# Altium project schematic_tutorial.PrjPcb
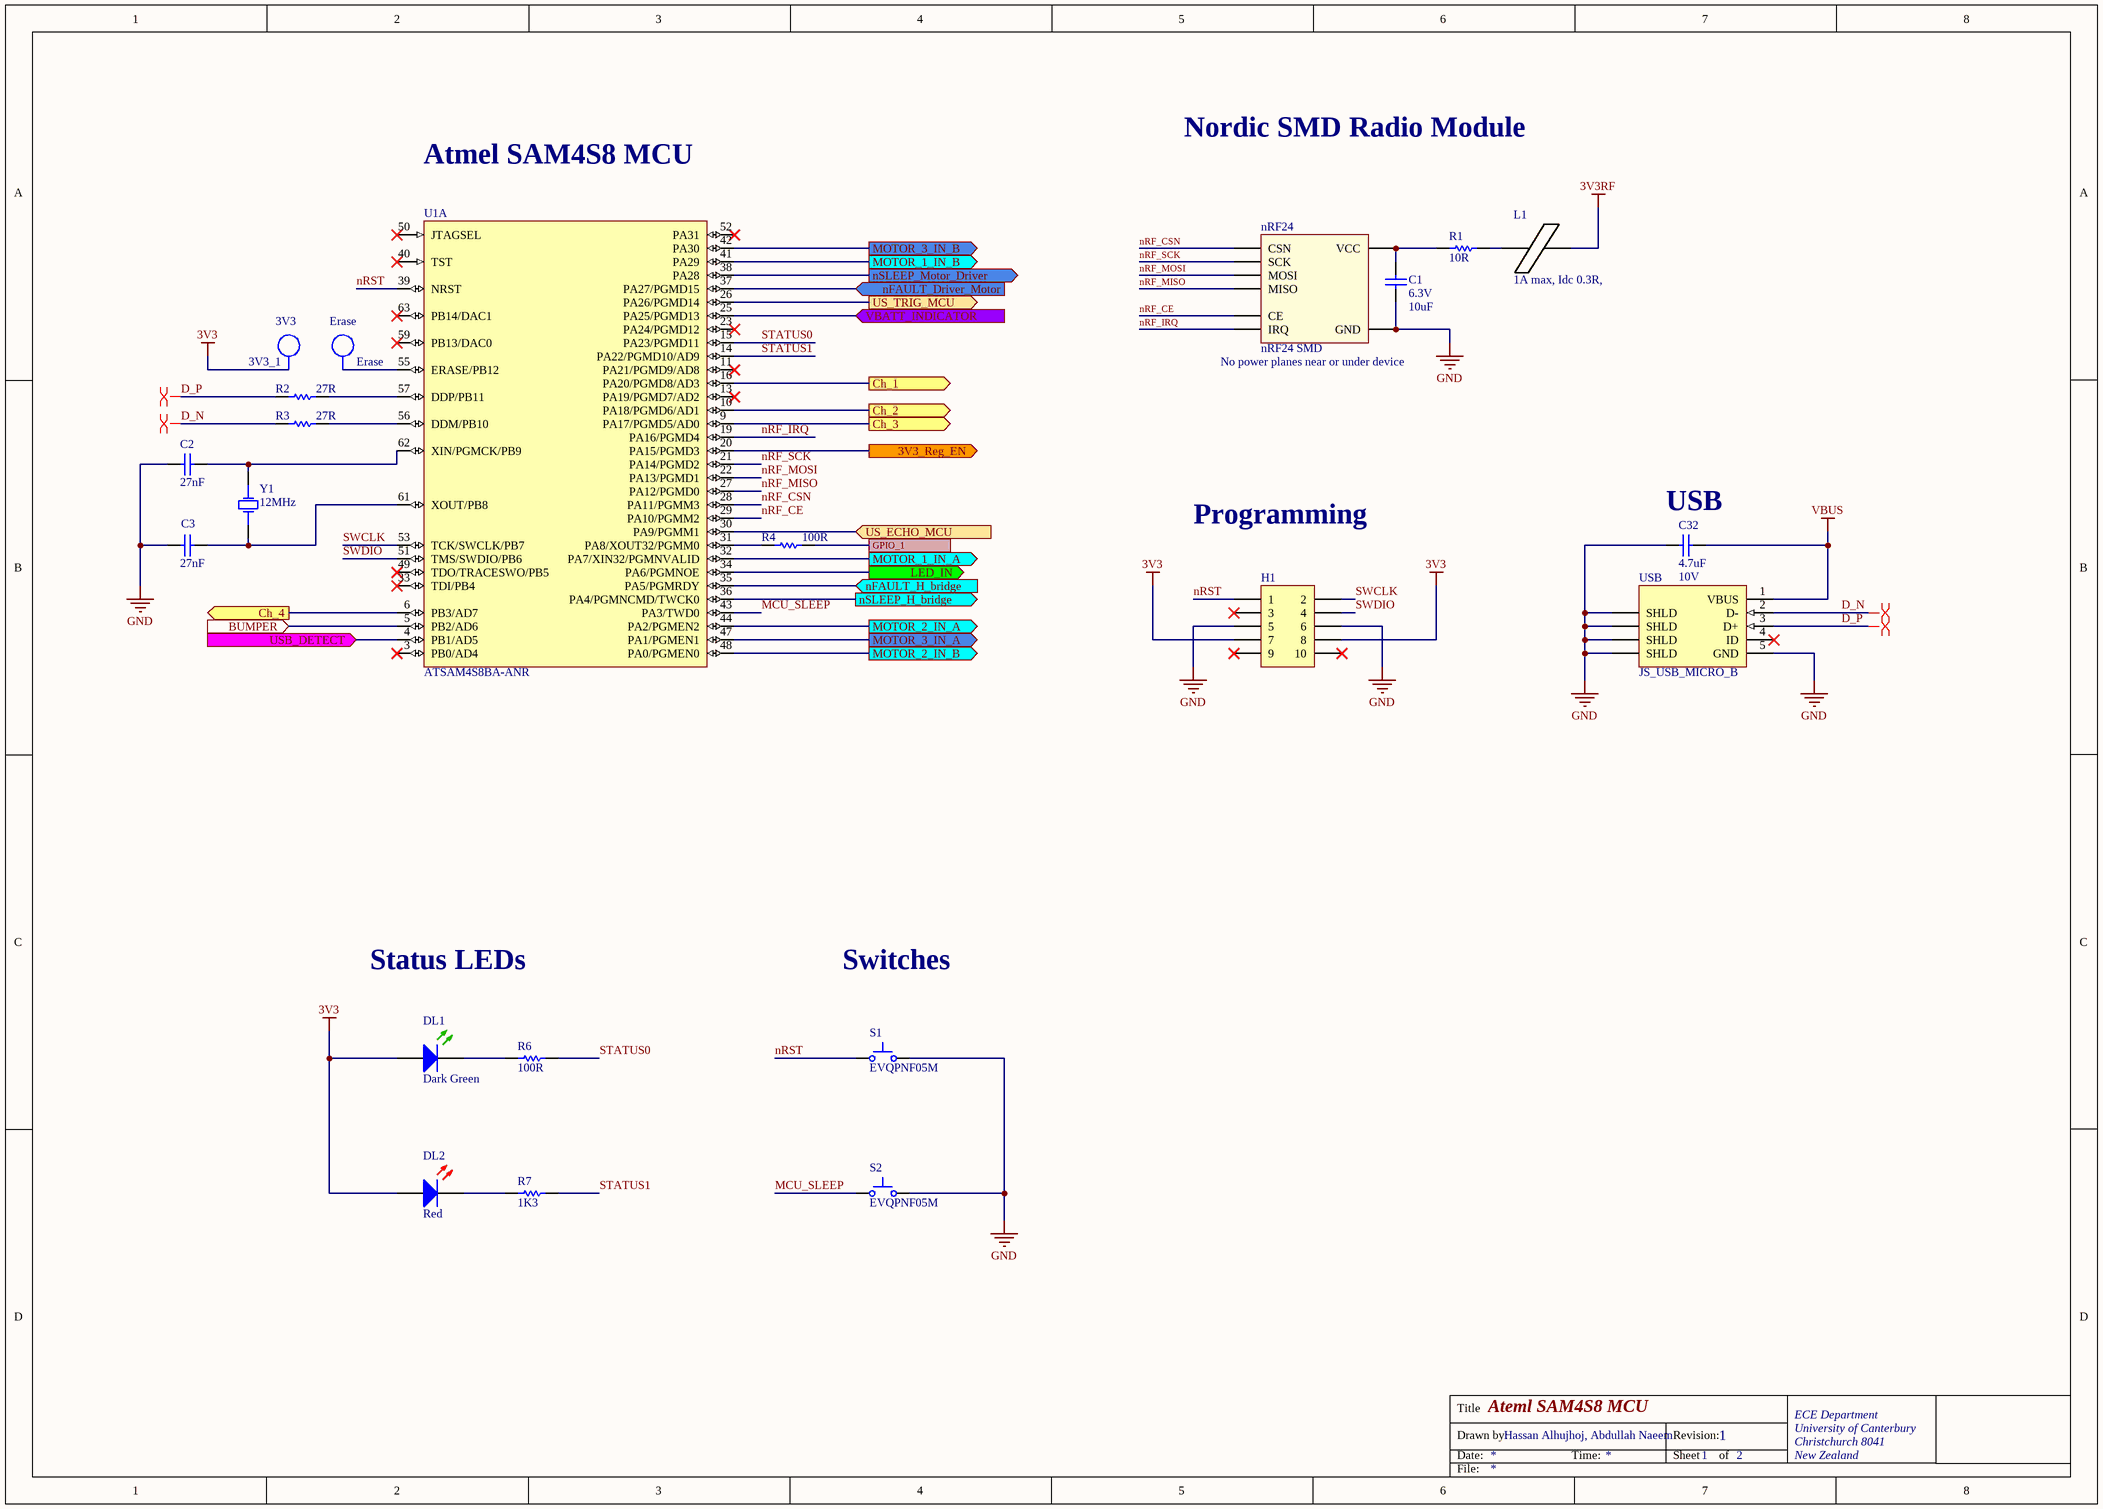
[diagram p0: MCU.SchDoc]
3 sheets, 86 parts. Net scope: global (net labels, ports and power ports of the same name join across sheets).
Sheets:
  MCU.SchDoc
  Power.SchDoc
  Headers.SchDoc

## Sheet MCU.SchDoc: Ateml SAM4S8 MCU
size A3; DrawnBy: Hassan Alhujhoj, Abdullah Naeem; Address1: ECE Department; Address2: University of Canterbury; Address3: Christchurch 8041; Address4: New Zealand; Revision: 1; SheetNumber: 1; SheetTotal: 2

### Parts
3V3_1  TP  [TP_1206]  (value not drawn)  (no BOM)
C1  Voltage - Rated: 6.3V  [CAPC1608L]  (hidden comment: 10uF)
C2  27nF  [CAPC1608L]
C3  27nF  [CAPC1608L]
C32  Max Voltage: 10V  [CAPC1608N]  (hidden comment: 4.7uF)
DL1  Dark Green  [WL-SMCW0603]
DL2  Red  [WL-SMCW0603]
Erase  TP  [TP_1206]  (value not drawn)  (no BOM)
H1  Header 5X2 Vert  [IDC2.54-V10D]  (value not drawn)
L1  1A max, Idc 0.3R,  [INDC3216L]
nRF24  nRF24 SMD  Warning: No power planes near or under device  [NRF24]
R1  10R  [RESC1608L]
R2  27R  [RESC1608L]
R3  27R  [RESC1608L]
R4  100R  [RESC1608L]
R6  100R  [RESC1608L]
R7  1K3  [RESC1608L]
S1  EVQPNF05M  [EVQPNF05M]
S2  EVQPNF05M  [EVQPNF05M]
U1  ATSAM4S8BA-ANR  [LQFP64_L]  (part A of 2)
USB  JS_USB_MICRO_B  [FCI_USB_10118194-0001LF]
Y1  12MHz  [6.0X3.5-4]

### Ports
3V3_Reg_EN (out), BUMPER (in), Ch_1 (out), Ch_2 (out), Ch_3 (out), Ch_4 (out), GPIO_1, LED_IN (out), MOTOR_1_IN_A (out), MOTOR_1_IN_B (out), MOTOR_2_IN_A (out), MOTOR_2_IN_B (out), MOTOR_3_IN_A (out), MOTOR_3_IN_B (out), nFAULT_Driver_Motor (in), nFAULT_H_bridge (in), nSLEEP_H_bridge (out), nSLEEP_Motor_Driver (out), US_ECHO_MCU (in), US_TRIG_MCU (out), USB_DETECT (in), VBATT_INDICATOR (in)

### Nets
3V3: 3V3_1.1 DL1.2(A) DL2.2(A) H1.7 H1.8
3V3RF: L1.2
GND: C1.1 C2.1 C3.1 C32.1 H1.5 H1.6 nRF24.2(GND) S1.2 S2.2 USB.5(GND) USB.6(SHLD)
VBUS: C32.2 USB.1(VBUS)
D_N: R3.1 USB.2(D-)
D_P: R2.1 USB.3(D+)
MCU_SLEEP: S2.1 U1.43(PA3/TWD0)
nRF_CE: nRF24.3(CE) U1.29(PA10/PGMM2)
nRF_CSN: nRF24.4(CSN) U1.28(PA11/PGMM3)
nRF_IRQ: nRF24.8(IRQ) U1.19(PA16/PGMD4)
nRF_MISO: nRF24.7(MISO) U1.27(PA12/PGMD0)
nRF_MOSI: nRF24.6(MOSI) U1.22(PA13/PGMD1)
nRF_SCK: nRF24.5(SCK) U1.21(PA14/PGMD2)
nRST: H1.1 S1.1 U1.39(NRST)
STATUS0: R6.2 U1.15(PA23/PGMD11)
STATUS1: R7.2 U1.14(PA22/PGMD10/AD9)
SWCLK: H1.2 U1.53(TCK/SWCLK/PB7)
SWDIO: H1.4 U1.51(TMS/SWDIO/PB6)
Net3V3RF_REG_3: U1.20(PA15/PGMD3) ; port 3V3_Reg_EN
NetBumper_2: U1.5(PB2/AD6) ; port BUMPER
NetC1_2: C1.2 nRF24.1(VCC) R1.1
NetC2_2: C2.2 U1.62(XIN/PGMCK/PB9) Y1.3(OSC2)
NetC3_2: C3.2 U1.61(XOUT/PB8) Y1.1(OSC1)
NetCH1_1: U1.16(PA20/PGMD8/AD3) ; port Ch_1
NetCH2_1: U1.10(PA18/PGMD6/AD1) ; port Ch_2
NetCH3_1: U1.9(PA17/PGMD5/AD0) ; port Ch_3
NetCH4_1: U1.6(PB3/AD7) ; port Ch_4
NetDL1_1: DL1.1(K) R6.1
NetDL2_1: DL2.1(K) R7.1
NetErase_1: Erase.1 U1.55(ERASE/PB12)
NetH4_2: R4.2 ; port GPIO_1
NetH-Bridge_1_1: U1.36(PA4/PGMNCMD/TWCK0) ; port nSLEEP_H_bridge
NetH-Bridge_1_8: U1.35(PA5/PGMRDY) ; port nFAULT_H_bridge
NetH-Bridge_1_9: U1.44(PA2/PGMEN2) ; port MOTOR_2_IN_A
NetH-Bridge_1_10: U1.48(PA0/PGMEN0) ; port MOTOR_2_IN_B
NetH-Bridge_1_15: U1.41(PA29) ; port MOTOR_1_IN_B
NetH-Bridge_1_16: U1.32(PA7/XIN32/PGMNVALID) ; port MOTOR_1_IN_A
NetH-Bridge_2_1: U1.38(PA28) ; port nSLEEP_Motor_Driver
NetH-Bridge_2_8: U1.37(PA27/PGMD15) ; port nFAULT_Driver_Motor
NetH-Bridge_2_9: U1.47(PA1/PGMEN1) ; port MOTOR_3_IN_A
NetH-Bridge_2_10: U1.42(PA30) ; port MOTOR_3_IN_B
NetL1_1: L1.1 R1.2
NetLVL_CON_3: U1.34(PA6/PGMNOE) ; port LED_IN
NetR2_2: R2.2 U1.57(DDP/PB11)
NetR3_2: R3.2 U1.56(DDM/PB10)
NetR4_1: R4.1 U1.31(PA8/XOUT32/PGMM0)
NetR15_1: U1.25(PA25/PGMD13) ; port VBATT_INDICATOR
NetR16_1: U1.4(PB1/AD5) ; port USB_DETECT
NetR17_1: U1.30(PA9/PGMM1) ; port US_ECHO_MCU
NetU1_26: U1.26(PA26/PGMD14) ; port US_TRIG_MCU

Not connected (* = marked no-connect by the designer): H1 3* 9* 10*; U1 3(PB0/AD4)* 11(PA21/PGMD9/AD8)* 13(PA19/PGMD7/AD2)* 23(PA24/PGMD12)* 33(TDI/PB4)* 40(TST)* 49(TDO/TRACESWO/PB5)* 50(JTAGSEL)* 52(PA31)* 59(PB13/DAC0)* 63(PB14/DAC1)*; USB 4(ID)*

### Layout directives
differential pair: D_N, D_P

### Notes on the sheet
- Atmel SAM4S8 MCU
- Nordic SMD Radio Module
- (near 3V3_1) 3V3
- (near Erase) Erase
- (near C32) USB
- Programming
- Status LEDs
- Switches
- Title
- Drawn by:
- Date:
- Time:
- Revision:
- Sheet
- of
- File:

### Library data of the parts
3V3_1 Erase = TP_1206: Test-Point 3.3x1.6x2.1mm SMD; Manufacturer: Harwin Inc; Manufacturer Part Number: S1751-46R; Manufacturer PN: *; Storage Location: ProtoPlace; Mounting Type: Surface Mount; Type: PC Test Point; Supplier 1: Digi-Key; Supplier Part Number 1: 952-1478-2-ND; Supplier 2: Farnell; Supplier Part Number 2: 1826282; Supplier: ECE Dept; Value: TP
C1 = CC_10uF_0603: CAP CER 10UF X5R +-20% 6V3 0603; Supplier: ECE Dept; Storage Location: PCB Assembly WS; Value: 10uF
C2 C3 = CC_27nF_0603: CAP CER 27nF X7R +-10% 50V 0603; PackageReference: 0603; Code_IPC: 1608 [0603]; Verify: *; Supplier: ECE Dept; Storage Location: PCB Assembly WS; Value: 27nF
C32 = CC_4.7uF_0603: CAP CER 4.7uF X5R +-20%  10V 0603; Note: Footprint corresponds to dimensions for bulk cassette packaging. This case size has tightened tolerances.; PackageReference: 0805; Code_IPC: 2012[0805]; Verify: *; Supplier: ECE Dept; Storage Location: PCB Assembly WS; Value: 4.7uF
DL1 = DL_150060GS75000: LED Dk Green 430mcd 0603 SMD; Manufacturer: WURTH ELEKTRONIK; Forward Current If: 30; Wavelength Typ: 520; Forward Voltage: 3.2; Lens Shape: Rectangular; Luminous Intensity: 430; Viewing Angle: 140°; LED Mounting: SMD; Supplier 1: Farnell; Supplier Part Number 1: 2322070; Manufacturer Part Number: 150060GS75000; Storage Location: PCB Assembly WS; Supplier: ECE Dept; LED Colour: Dark Green
DL2 = DL_150060RS75000: LED Red 250mcd 0603 SMD; Manufacturer: WURTH ELEKTRONIK; Forward Current If: 30; Forward Voltage: 2; Lens Shape: Rectangular; Luminous Intensity: 250; Wavelength Typ: 625; Viewing Angle: 140°; LED Mounting: SMD; Supplier 1: Farnell; Supplier Part Number 1: 2322071; Manufacturer Part Number: 150060RS75000; Storage Location: PCB Assembly WS; Supplier: ECE Dept; LED Colour: Red
H1 = JA_HDR_IDC_5X2_VERT: IDC Header, 2,54mm, 10-Pin, Vert; Supplier: ECE Dept; Supplier 1: Farnell; Supplier Part Number 1: 1096985; Storage Location: ECE Dept Store
L1 = IN_Ferrite-Bead: Ferrite Bead, Rdc 0.3R, Z100MHZ 600R, Imax 1A, SMD 1206; Manufacturer: FAIR-RITE; Manufacturer PN: 2512066017Y1; DC Current Rating: 1; DC Resistance Max: 0.08; Ferrite Case Style: 1206 ^3216 Metric]; Frequency Range: 50MHz to 1; Impedance: 600; Impedance Tolerance: ± 25%; Supplier: ECE Dept; Storage Location: PCB Assembly WS; Ferrite Mounting: SMD; Supplier 1: Farnell; Supplier Part Number 1: 1612060; Manufacturer Part Number: 2512066017Y1; Value: 1A max, Idc 0.3R,
nRF24 = NRF24: nRF24 SMD Module
R1 = RS_10R: RES 10 OHM 1/10W 5% 0603 SMD; Storage Location: PCB Assembly WS; Supplier: ECE Dept; Value: 10R
R2 R3 = RS_27R: RES 27 OHM 1/10W 5% 0603 SMD; Storage Location: PCB Assembly WS; Supplier: ECE Dept; Value: 27R
R4 R6 = RS_100R: RES 100 OHM 1/10W 5% 0603 SMD; Storage Location: PCB Assembly WS; Supplier: ECE Dept; Value: 100R
R7 = RS_1K3: RES 1.3K OHM 1/10W 5% 0603 SMD; Storage Location: PCB Assembly WS; Supplier: ECE Dept; Value: 1K3
S1 S2 = WS_EVQPNF05M: Panasonic 6 x 3.5mm SMD Light Touch Switch Type SMD; PackageDescription: 6.0 x 3.5 mm; Supplier 1: Farnell; Supplier Part Number 1: 2079481; Manufacturer: Panasonic; Manufacturer PN: EVQPNF05M; Supplier 2: Digi-Key; Supplier Part Number 2: P13598SCT-ND; Storage Location: PCB Assembly WS; Supplier: ECE Dept
U1 = SE_ATSAM4S16BA-MU: IC MCU 32BIT 512KB FLASH 64LQFP; Manufacturer: Atmel; Connectivity: I²C, IrDA, Memory Card, SPI, SSC, UART/USART, USB; Core Processor: ARM® Cortex®-M4; Core Size: 32-Bit; Data Converters: A/D 11x12b, D/A 2x12b; Number of I/O: 47; Peripherals: Brown-out Detect/Reset, DMA, POR, PWM, WDT; Program Memory Size: 512KB (512K x 8); RAM Size: 128K x 8; Speed: 120MHz; Voltage - Supply (Vcc/Vdd): 1.62 V ~ 3.6 V; PackageVersion: revJ, Jul-2007; PackageReference: 64PS; PackageDescription: 64-Pin Quad Flat No-Lead (QFN) Sawn, 9 x 9 x 1.0 mm Body, 0.5 mm Pitch, Exposed Pad; Code_JEDEC: MO-220VMMD-3; ComponentLink1Description: Manufacturer URL; ComponentLink1URL: http://www.atmel.com/; ComponentLink2Description: SAM4S Series Datasheet; ComponentLink2URL: http://www.atmel.com/dyn/resources/prod_documents/11100.pdf; ComponentLink3Description: SAM4S Series Summary; ComponentLink3URL: http://www.atmel.com/dyn/resources/prod_documents/11100S.pdf; Supplier 1: Digi-Key; Package / Case: 64-LQFP; Packaging: Cut Tape (CT); Program Memory Type: FLASH; Supplier Part Number 1: ATSAM4S8BA-ANRCT-ND; Manufacturer Part Number: ATSAM4S8BA-ANR
USB = JS_USB_MICRO_B_SMT: CONN USB MICRO B RECPT SMT R/A; Manufacturer: FCI; Manufacturer Part Number: 10118194-0001LF; Gender: Receptacle; Number of Contacts: 5; Specifications: USB 2.0; Supplier 1: Digi-Key; Supplier Part Number 1: 609-4618-1-ND; Features: Shielded, Solder Retention; Mounting Type: Surface Mount, Right Angle, Horizontal
Y1 = XT_CRYSTAL_12MHz_18pF: CRYSTAL 12MHZ 18PF 6X3.5mm SMD; Manufacturer: CTS-Frequency Controls; Manufacturer Part Number: 406C35D12M00000; ESR (Equivalent Series Resistance): 60 Ohm; Frequency Stability: ±50ppm; Frequency Tolerance: ±30ppm; Operating Mode: Fundamental; Supplier 1: Digi-Key; Height: 0.047" (1.20mm); Load Capacitance: 18pF; Mounting Type: Surface Mount; Operating Temperature: -20°C ~ 70°C; Package / Case: 4-SMD, No Lead (DFN, LCC); Size / Dimension: 0.236" L x 0.138" W (6.00mm x 3.50mm); Supplier Part Number 1: CTX855CT-ND; Frequency: 12MHz

## Sheet Power.SchDoc: Power Electronics
size A3; DrawnBy: Hassan Alhujhoj, Abdullah Naeem; Address1: ECE Department; Address2: University of Canterbury; Address3: Christchurch 8041; Address4: New Zealand; SheetNumber: 2; SheetTotal: 2; Rule: UNIONINDEX=0|RULEKIND=Clearance|NETSCOPE=DifferentNets|LAYERKIND=SameLayer|NAME=Schematic Clearance Constraint|GAP=10mil|GENERICCLEARANCE=10mil|IGNOREPADTOPADCLEARANCEINFOOTPRINT=FALSE|OBJECTCLEARANCES=ClearanceObj_Arc-ClearanceObj_Hole:0;ClearanceObj_Track-ClearanceObj_Hole:0;ClearanceObj_SMDPad-ClearanceObj_Hole:0;ClearanceObj_THPad-ClearanceObj_Hole:0;ClearanceObj_Via-ClearanceObj_Hole:0;ClearanceObj_Fill-ClearanceObj_Hole:0;ClearanceObj_Poly-ClearanceObj_Hole:0;ClearanceObj_Region-ClearanceObj_Hole:0;ClearanceObj_Text-ClearanceObj_Hole:0|UNIT=Imperial
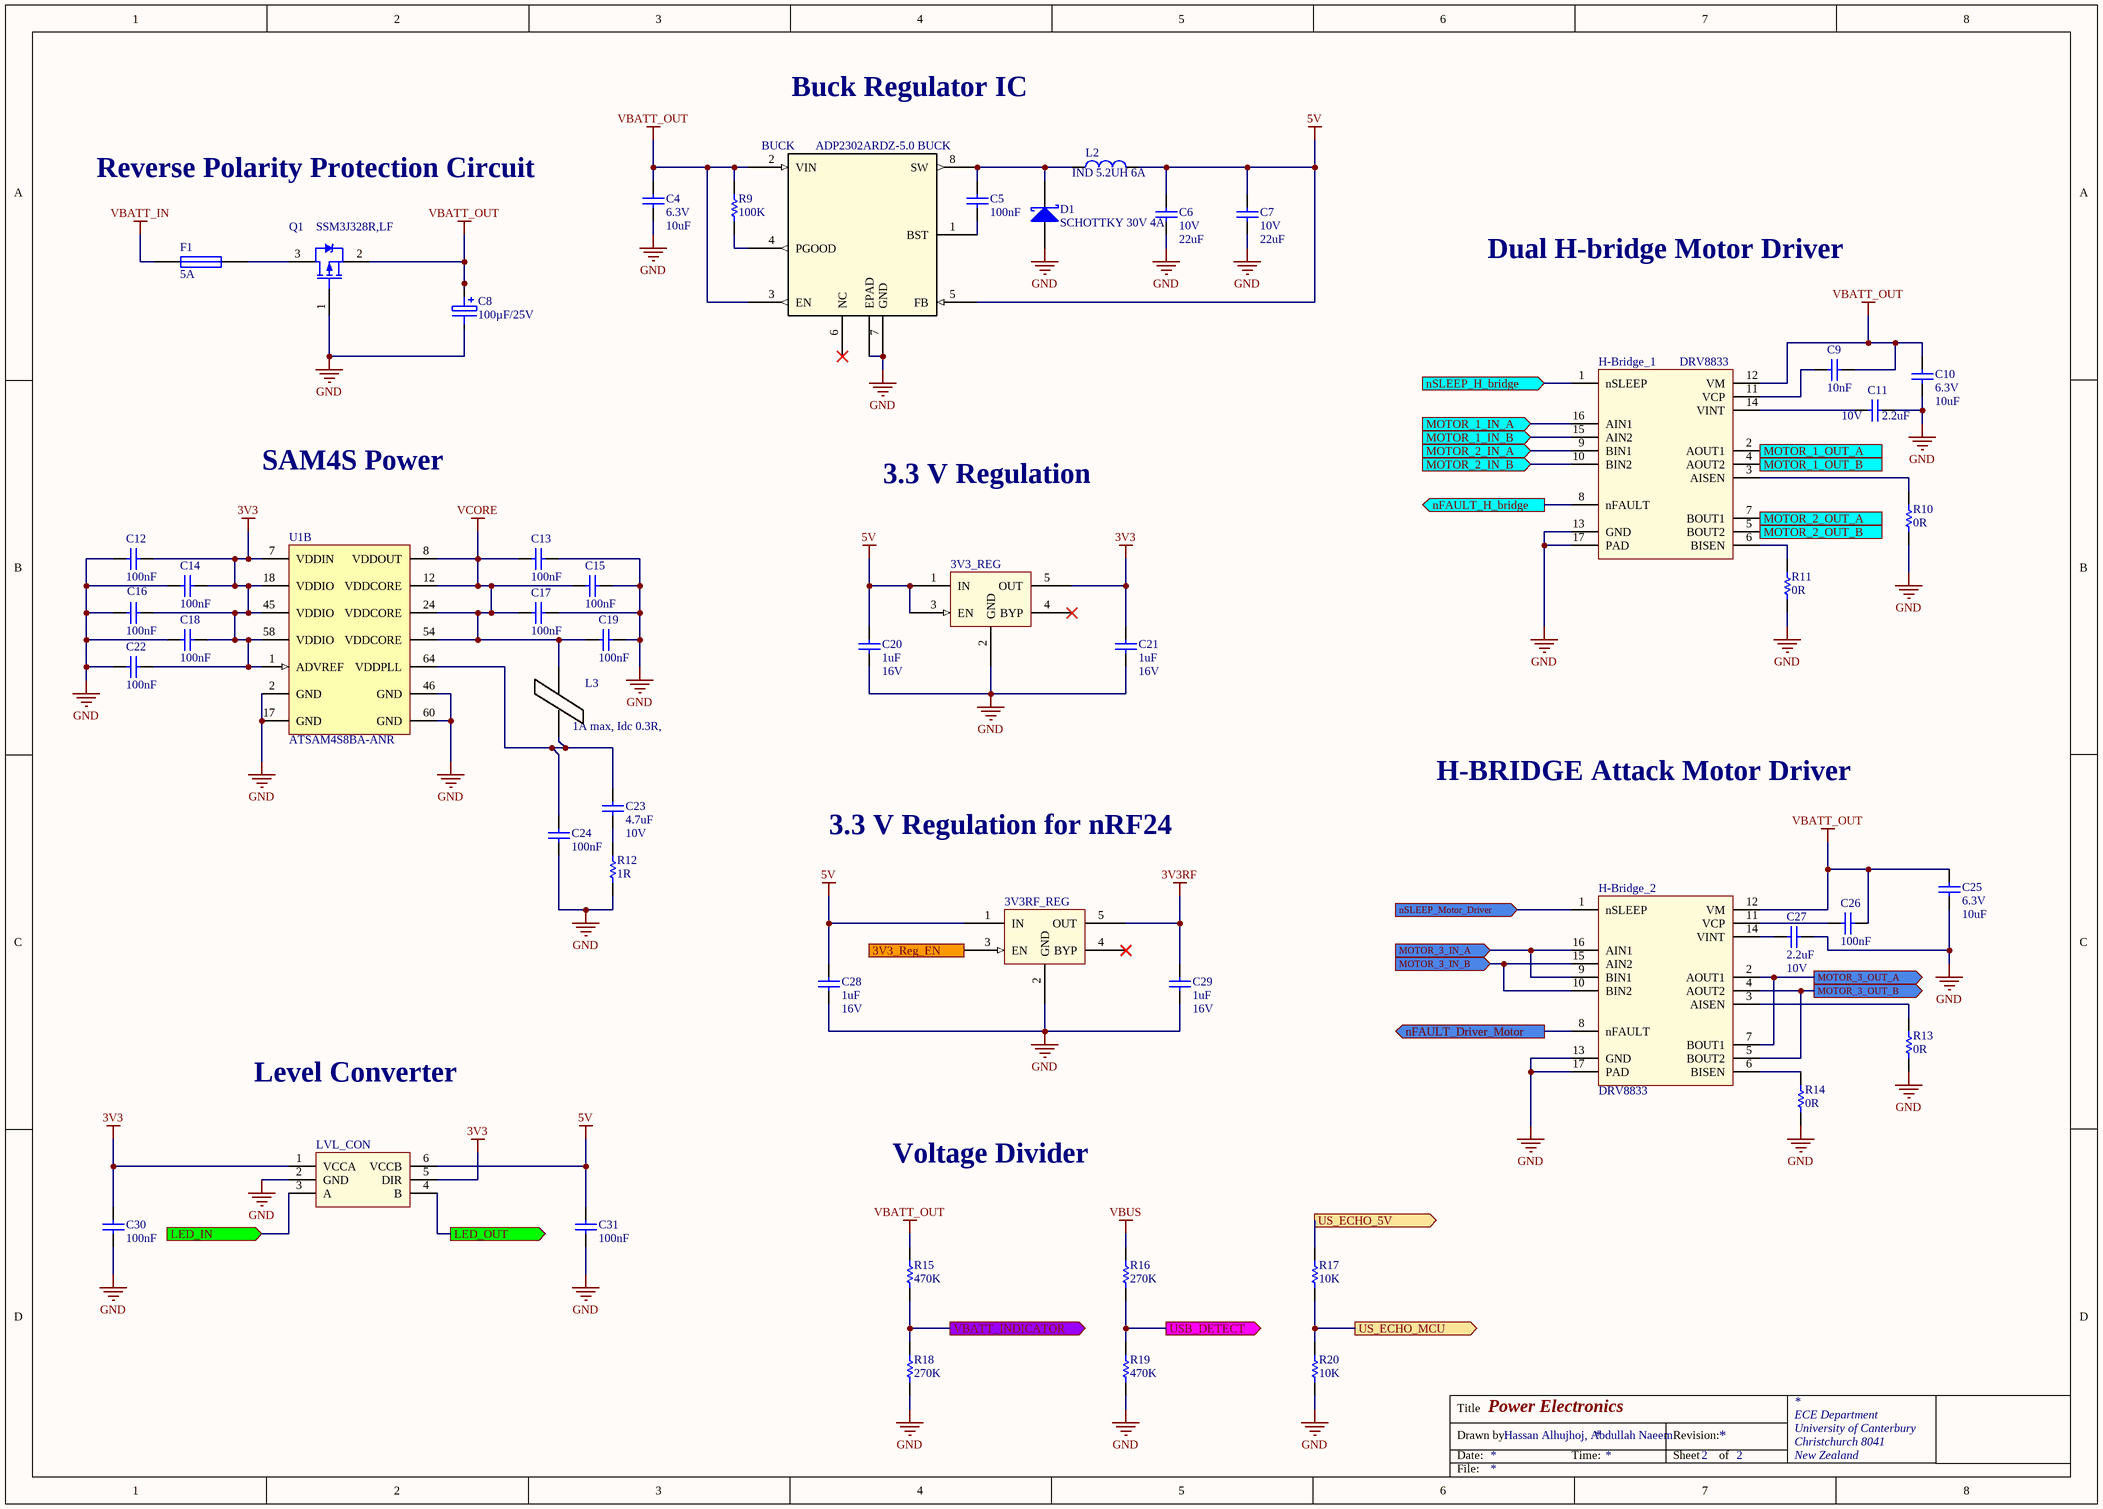
[diagram p1: Power.SchDoc]

### Parts
3V3_REG  CAT6219-330TDGT3  [SOT95P280X145-5N]  (value not drawn)
3V3RF_REG  CAT6219-330TDGT3  [SOT95P280X145-5N]  (value not drawn)
BUCK  ADP2302ARDZ-5.0 BUCK  [RD_8_1]
C4  Voltage - Rated: 6.3V  [CAPC1608L]  (hidden comment: 10uF)
C5  100nF  [CAPC1608L]
C6  Max Voltage: 10V  [CAPC3216L]  (hidden comment: 22uF)
C7  Max Voltage: 10V  [CAPC3216L]  (hidden comment: 22uF)
C8  100µF/25V  [CAPAE6666X77M]
C9  10nF  [CAPC1608L]
C10  Voltage - Rated: 6.3V  [CAPC1608L]  (hidden comment: 10uF)
C11  Max Voltage: 10V  [CAPC1608L]  (hidden comment: 2.2uF)
C12  100nF  [CAPC1608L]
C13  100nF  [CAPC1608L]
C14  100nF  [CAPC1608L]
C15  100nF  [CAPC1608L]
C16  100nF  [CAPC1608L]
C17  100nF  [CAPC1608L]
C18  100nF  [CAPC1608L]
C19  100nF  [CAPC1608L]
C20  Max Voltage: 16V  [CAPC1608L]  (hidden comment: 1uF)
C21  Max Voltage: 16V  [CAPC1608L]  (hidden comment: 1uF)
C22  100nF  [CAPC1608L]
C23  Max Voltage: 10V  [CAPC1608N]  (hidden comment: 4.7uF)
C24  100nF  [CAPC1608L]
C25  Voltage - Rated: 6.3V  [CAPC1608L]  (hidden comment: 10uF)
C26  100nF  [CAPC1608L]
C27  Max Voltage: 10V  [CAPC1608L]  (hidden comment: 2.2uF)
C28  Max Voltage: 16V  [CAPC1608L]  (hidden comment: 1uF)
C29  Max Voltage: 16V  [CAPC1608L]  (hidden comment: 1uF)
C30  100nF  [CAPC1608L]
C31  100nF  [CAPC1608L]
D1  SCHOTTKY 30V 4A  [SMC]
F1  5A  [RESC3216N]
H-Bridge_1  DRV8833  [HTSOP16]
H-Bridge_2  DRV8833  [HTSOP16]
L2  IND 5.2UH 6A  [INDUCTOR5u2]
L3  1A max, Idc 0.3R,  [INDC3216L]
LVL_CON  SN74LVC1T45  [SOT23-6_N]  (value not drawn)
Q1  SSM3J328R,LF  [SOT23_L]
R9  100K  [RESC1608L]
R10  0R  [RESC1608L]
R11  0R  [RESC1608L]
R12  1R  [RESC3216L]
R13  0R  [RESC1608L]
R14  0R  [RESC1608L]
R15  470K  [RESC1608L]
R16  270K  [RESC1608L]
R17  10K  [RESC1608L]
R18  270K  [RESC1608L]
R19  470K  [RESC1608L]
R20  10K  [RESC1608L]
U1  ATSAM4S8BA-ANR  [LQFP64_L]  (part B of 2)

### Ports
3V3_Reg_EN (in), LED_IN (in), LED_OUT (out), MOTOR_1_IN_A (in), MOTOR_1_IN_B (in), MOTOR_1_OUT_A (out), MOTOR_1_OUT_B (out), MOTOR_2_IN_A (in), MOTOR_2_IN_B (in), MOTOR_2_OUT_A (out), MOTOR_2_OUT_B (out), MOTOR_3_IN_A (in), MOTOR_3_IN_B (in), MOTOR_3_OUT_A (out), MOTOR_3_OUT_B (out), nFAULT_Driver_Motor (out), nFAULT_H_bridge (out), nSLEEP_H_bridge (in), nSLEEP_Motor_Driver (in), US_ECHO_5V (out), US_ECHO_MCU (out), USB_DETECT (out), VBATT_INDICATOR (out)

### Nets
3V3: 3V3_REG.5(OUT) C12.2 C14.2 C16.2 C18.2 C21.2 C22.2 C30.2 LVL_CON.1(VCCA) LVL_CON.5(DIR) U1.1(ADVREF) U1.7(VDDIN) U1.18(VDDIO) U1.45(VDDIO) U1.58(VDDIO)
3V3RF: 3V3RF_REG.5(OUT) C29.2
5V: 3V3_REG.1(IN) 3V3_REG.3(EN) 3V3RF_REG.1(IN) BUCK.5(FB) C6.2 C7.2 C20.1 C28.1 C31.2 L2.2 LVL_CON.6(VCCB)
GND: 3V3_REG.2(GND) 3V3RF_REG.2(GND) BUCK.7(GND) BUCK.EPAD C4.1 C6.1 C7.1 C8.1 C10.1 C11.2 C12.1 C13.2 C14.1 C15.2 C16.1 C17.2 C18.1 C19.2 C20.2 C21.1 C22.1 C24.1 C25.1 C27.2 C28.2 C29.1 C30.1 C31.1 D1.1(A) H-Bridge_1.13(GND) H-Bridge_1.17(PAD) H-Bridge_2.13(GND) H-Bridge_2.17(PAD) LVL_CON.2(GND) Q1.1 R10.2 R11.1 R12.2 R13.2 R14.2 R18.1 R19.1 R20.1 U1.2(GND) U1.17(GND) U1.46(GND) U1.60(GND)
VBATT_IN: F1.1
VBATT_OUT: BUCK.2(VIN) BUCK.3(EN) C4.2 C8.2 C9.2 C10.2 C25.2 C26.2 H-Bridge_1.12(VM) H-Bridge_2.12(VM) Q1.2 R9.2 R15.2
VBUS: R16.2
VCORE: C13.1 C15.1 C17.1 C19.1 L3.2 U1.8(VDDOUT) U1.12(VDDCORE) U1.24(VDDCORE) U1.54(VDDCORE)
Net3V3RF_REG_3: 3V3RF_REG.3(EN) ; port 3V3_Reg_EN
NetBUCK_1: BUCK.1(BST) C5.1
NetBUCK_4: BUCK.4(PGOOD) R9.1
NetBUCK_8: BUCK.8(SW) C5.2 D1.2(K) L2.1
NetC9_1: C9.1 H-Bridge_1.11(VCP)
NetC11_1: C11.1 H-Bridge_1.14(VINT)
NetC23_1: C23.1 R12.1
NetC23_2: C23.2 C24.2 L3.1 U1.64(VDDPLL)
NetC26_1: C26.1 H-Bridge_2.11(VCP)
NetC27_1: C27.1 H-Bridge_2.14(VINT)
NetF1_2: F1.2 Q1.3
NetH-Bridge_1_1: H-Bridge_1.1(nSLEEP) ; port nSLEEP_H_bridge
NetH-Bridge_1_2: H-Bridge_1.2(AOUT1) ; port MOTOR_1_OUT_A
NetH-Bridge_1_3: H-Bridge_1.3(AISEN) R10.1
NetH-Bridge_1_4: H-Bridge_1.4(AOUT2) ; port MOTOR_1_OUT_B
NetH-Bridge_1_5: H-Bridge_1.5(BOUT2) ; port MOTOR_2_OUT_B
NetH-Bridge_1_6: H-Bridge_1.6(BISEN) R11.2
NetH-Bridge_1_7: H-Bridge_1.7(BOUT1) ; port MOTOR_2_OUT_A
NetH-Bridge_1_8: H-Bridge_1.8(nFAULT) ; port nFAULT_H_bridge
NetH-Bridge_1_9: H-Bridge_1.9(BIN1) ; port MOTOR_2_IN_A
NetH-Bridge_1_10: H-Bridge_1.10(BIN2) ; port MOTOR_2_IN_B
NetH-Bridge_1_15: H-Bridge_1.15(AIN2) ; port MOTOR_1_IN_B
NetH-Bridge_1_16: H-Bridge_1.16(AIN1) ; port MOTOR_1_IN_A
NetH-Bridge_2_1: H-Bridge_2.1(nSLEEP) ; port nSLEEP_Motor_Driver
NetH-Bridge_2_2: H-Bridge_2.2(AOUT1) H-Bridge_2.7(BOUT1) ; port MOTOR_3_OUT_A
NetH-Bridge_2_3: H-Bridge_2.3(AISEN) R13.1
NetH-Bridge_2_4: H-Bridge_2.4(AOUT2) H-Bridge_2.5(BOUT2) ; port MOTOR_3_OUT_B
NetH-Bridge_2_6: H-Bridge_2.6(BISEN) R14.1
NetH-Bridge_2_8: H-Bridge_2.8(nFAULT) ; port nFAULT_Driver_Motor
NetH-Bridge_2_9: H-Bridge_2.9(BIN1) H-Bridge_2.16(AIN1) ; port MOTOR_3_IN_A
NetH-Bridge_2_10: H-Bridge_2.10(BIN2) H-Bridge_2.15(AIN2) ; port MOTOR_3_IN_B
NetLED_TAPE_2: LVL_CON.4(B) ; port LED_OUT
NetLVL_CON_3: LVL_CON.3(A) ; port LED_IN
NetR15_1: R15.1 R18.2 ; port VBATT_INDICATOR
NetR16_1: R16.1 R19.2 ; port USB_DETECT
NetR17_1: R17.1 R20.2 ; port US_ECHO_MCU
NetR17_2: R17.2 ; port US_ECHO_5V

Not connected (* = marked no-connect by the designer): 3V3_REG 4(BYP)*; 3V3RF_REG 4(BYP)*; BUCK 6(NC)*

### Notes on the sheet
- Buck Regulator IC
- Reverse Polarity Protection Circuit
- Dual H-bridge Motor Driver
- SAM4S Power
- 3.3 V Regulation
- H-BRIDGE Attack Motor Driver
- 3.3 V Regulation for nRF24
- Level Converter
- Voltage Divider
- Title
- Drawn by:
- Date:
- Time:
- Revision:
- Sheet
- of
- File:

### Library data of the parts
3V3_REG 3V3RF_REG = SV_CAT6219-330TDGT3: IC REG LIN 3.3V 500MA TSOT23-5; Voltage - Input (Max): 5.5V; Voltage Dropout (Max): 0.5V @ 500mA; Manufacturer Part Number: CAT6219-330TDGT3; Base Part Number: CAT6219; Current - Output: 500mA; Package / Case: SOT-23-5 Thin, TSOT-23-5; Supplier: Digi-Key; Supplier Device Package: TSOT-23-5; Voltage - Output (Min/Fixed): 3.3V; ComponentLink1URL: http://www.onsemi.com/pub/Collateral/CAT6219-D.PDF; ComponentLink1Description: http://www.onsemi.com/pub/Collateral/CAT6219-D.PDF; Supplier 1: Digi-Key
BUCK = ADP2302ARDZ-5.0-R7: IC REG BUCK 5V 2A 8SOIC; Vendor: Analog Devices Inc; Frequency - Switching: 700kHz; Output Type: Fixed; Voltage - Input (Max): 20V; Manufacturer_Part_Number: ADP2302ARDZ-5.0-R7; Type: DEV; Value: Value; Supplier 1: Digi-Key; Current - Output: 2A; Voltage - Output (Min/Fixed): 5V; Supplier Part Number 1: ADP2302ARDZ-5.0-R7CT-ND
C4 C10 C25 = CC_10uF_0603: CAP CER 10UF X5R +-20% 6V3 0603; Supplier: ECE Dept; Storage Location: PCB Assembly WS; Value: 10uF
C5 C12-C19 C22 C24 C26 C30 C31 = CC_100nF_0603: CAP CER 100nF X7R +-10% 50V 0603; PackageReference: 0603; Code_IPC: 1608 [0603]; Verify: *; Supplier: ECE Dept; Storage Location: PCB Assembly WS; Value: 100nF
C6 C7 = CC_22uF_1206: CAP CER 22uF Y5V -20% +80% 10V 1206; Verify: *; Supplier: ECE Dept; Storage Location: PCB Assembly WS; Dielectric: Y5V; Footprint: 1206 (3216 metric); Value: 22uF
C8 = CA_100uF_25V: CAP ALUM 100UF 25V 20% SMD; Manufacturer: Nichicon; Manufacturer Part Number: UWT1E101MCL1GS; Ripple Current: 91mA; Supplier 1: Digi-Key; Height - Seated (Max): 0.303" (7.70mm); Mounting Type: Surface Mount; Operating Temperature: -55°C ~ 105°C; Package / Case: Radial, Can - SMD; Size / Dimension: 0.248" Dia (6.30mm); Supplier Part Number 1: 493-2190-1-ND; Capacitance: 100µF/25V
C9 = CC_10nF_0603: CAP CER 10nF X7R +-10% 50V 0603; PackageReference: 0603; Code_IPC: 1608 [0603]; Verify: *; Supplier: ECE Dept; Storage Location: PCB Assembly WS; Value: 10nF
C11 C27 = CC_2.2uF_0603: CAP CER 2.2uF X5R +-20% 10V 0603; PackageReference: 0603; Code_IPC: 1608 [0603]; Verify: *; Supplier: ECE Dept; Storage Location: PCB Assembly WS; Value: 2.2uF
C20 C21 C28 C29 = CC_1uF_0603: CAP CER 1uF Y5V -20% +80% 16V 0603; PackageReference: 0603; Code_IPC: 1608 [0603]; Verify: *; Supplier: ECE Dept; Storage Location: PCB Assembly WS; Value: 1uF
C23 = CC_4.7uF_0603: as C32 on sheet MCU; PackageReference: 0805; Code_IPC: 2012[0805]; Verify: *; Supplier: ECE Dept; Storage Location: PCB Assembly WS; Value: 4.7uF
D1 = MBRS330T3G: DIODE SCHOTTKY 30V 4A SMC; Manufacturer: ON Semiconductor; Speed: Fast Recovery =< 500ns, > 200mA (Io); Supplier 1: Digi-Key; Manufacturer Part Number: MBRS330T3G; RoHS: RoHS Compliant; Category: Discrete Semiconductor Products; Stock 1: 8919; Pricing 1: 1=0.93, 10=0.79, 100=0.5902, 500=0.46368, 1000=0.35829 (NZD); Packaging: Cut Tape (CT); Part Status: Active; Diode Type: Schottky; Current - Average Rectified (Io): 4A; Capacitance @ Vr, F: -; Mounting Type: Surface Mount; Package / Case: DO-214AB, SMC; Supplier Device Package: SMC; Operating Temperature - Junction: -65°C ~ 150°C; Base Part Number: MBRS330; ComponentLink1URL: http://www.onsemi.com/pub/Collateral/MBRS340T3-D.PDF; ComponentLink1Description: http://www.onsemi.com/pub/Collateral/MBRS340T3-D.PDF; Supplier Part Number 1: MBRS330T3GOSCT-ND
F1 = FS_Fuse_5.0A: Fuse 5.0A Fast Acting 1206 SMD; Manufacturer Part Number: C1F5; Manufacturer: Bel TRP; Voltage Rating (AC): 125V; Voltage Rating (DC): 63V; DC Cold Resistance: 19mR; Fuse Type: Board Mount (Cartridge Style Excluded); Approvals: CE,cURus; Mount: Surface Mount; Case/Package: 1206; Number of Pins: 2; Case Code (Metric): 3216; Case Code (Imperial): 1206; Contact Plating: Nickel,Tin; Min Operating Temperature: -55°C; Max Operating Temperature: 125°C; Packaging: Tape and Reel; Voltage Rating: 125V; Length: 0.126inch; Width: 0.062inch; Supplier 1: Digi-Key; Stock 1: 725; Pricing 1: 1=0.32, 5=0.312, 10=0.298, 50=0.2662, 100=0.2479, 250=0.22032, 500=0.1836, 1000=0.17442 (USD); ComponentLink1URL: http://www.farnell.com/datasheets/2571625.pdf; ComponentLink1Description: http://www.farnell.com/datasheets/2571625.pdf; ComponentLink2URL: http://belfuse.com/pdfs/C1F.pdf; ComponentLink2Description: http://belfuse.com/pdfs/C1F.pdf; ComponentLink3URL: http://www.mouser.com/ds/2/643/C1F-594910.pdf; ComponentLink3Description: http://www.mouser.com/ds/2/643/C1F-594910.pdf; ComponentLink4URL: https://belfuse.com/resources/StewartConnector/C1F.pdf; ComponentLink4Description: https://belfuse.com/resources/StewartConnector/C1F.pdf; Current Rating: 5A; Supplier Part Number 1: 507-1886-1-ND; Supplier 2: Element14; Supplier Part Number 2: 2848595; Value: 5A
H-Bridge_1 H-Bridge_2 = DRV8833: Dual H-Bridge Motor Driver 1.5A
L2 = CDRH104RNP-5R2NC: FIXED IND 5.2UH 6A 22 MOHM SMD; Manufacturer: Sumida America Components Inc.; Material - Core: Ferrite; Tolerance: ±30%; Current - Saturation: 5.6A; Shielding: Shielded; DC Resistance (DCR): 22 mOhm Max; Supplier 1: Digi-Key; Manufacturer Part Number: CDRH104RNP-5R2NC; RoHS: RoHS Compliant; Category: Inductors, Coils, Chokes; Stock 1: 3849; Pricing 1: 1=2.9, 10=2.678, 100=1.8743, 500=1.5173 (NZD); Packaging: Cut Tape (CT); Part Status: Active; Type: -; Q @ Freq: -; Frequency - Self Resonant: -; Ratings: -; Operating Temperature: -40°C ~ 100°C; Mounting Type: Surface Mount; Package / Case: Nonstandard; Supplier Device Package: -; Size / Dimension: 0.402" L x 0.394" W (10.20mm x 10.00mm); Height - Seated (Max): 0.157" (4.00mm); ComponentLink1URL: http://products.sumida.com/products/pdf/CDRH104R.pdf; ComponentLink1Description: http://products.sumida.com/products/pdf/CDRH104R.pdf; Supplier Part Number 1: 308-2280-1-ND
L3 = IN_Ferrite-Bead: as L1 on sheet MCU; Supplier: ECE Dept; Storage Location: PCB Assembly WS; Ferrite Mounting: SMD; Supplier 1: Farnell; Supplier Part Number 1: 1612060; Manufacturer Part Number: 2512066017Y1; Value: 1A max, Idc 0.3R,
LVL_CON = SN74LVC1T45: 1.8V - 5V level converter; ComponentLink1Description: Single-Bit Dual-Supply Bus Transceiver with Configurable Voltage-Level Shifting and 3-State Outputs; ComponentLink1URL: http://www.ti.com/lit/ds/symlink/sn74lvc1t45.pdf
Q1 = TM_SSM3J328R: MOSFET P-CH 20V 6A SOT23-3; Manufacturer: Toshiba; FET Feature: Logic Level Gate, 1.5V Drive; FET Type: MOSFET P-Channel, Metal Oxide; Gate Charge (Qg) @ Vgs: 12.8nC @ 4.5V; Input Capacitance (Ciss) @ Vds: 840pF @ 10V; Power - Max: 1W; Rds On Max: 29.8mR; Drain to Source Resistance: 47.4mR; Turn-On Delay Time: 32ns; Power Dissipation: 2W; Number of Channels: 1; Turn-Off Delay Time: 107ns; Gate to Source Voltage (Vgs): 8V; Input Capacitance: 840pF; Element Configuration: Single; Drain to Source Breakdown Voltage: -20V; Vgs(th) (Max) @ Id: 1V @ 1mA; Current - Continuous Drain (Id) @ 25° C: 6A; Drain to Source Voltage (Vdss): 20V; Package / Case: SOT-23-3 Flat Leads; Supplier Device Package: SOT-23F; Pricing: 1=0.79, 10=0.658, 25=0.5772, 100=0.4939, 250=0.42836, 500=0.36284, 1000=0.27972 (NZD); Storage Location: PCB Assembly WS; Supplier: Digi-Key; ComponentLink1URL: https://datasheet.ciiva.com/11158/ssm3j328r-datasheet-en-20140301-11158652.pdf; ComponentLink1Description: https://datasheet.ciiva.com/11158/ssm3j328r-datasheet-en-20140301-11158652.pdf; Supplier Part Number: SSM3J328RLFDKR-ND; Max Operating Temperature: 150°C; Mount: Surface Mount; Packaging: Tape and Reel; Min Operating Temperature: -55°C; Continuous Drain Current (ID): 6A; Radiation Hardening: No; Max Power Dissipation: 1W; Package Quantity: 3000; Case/Package: SOT-23-3; Number of Pins: 3; Number of Elements: 1; Supplier 1: Digi-Key; Supplier Part Number 1: SSM3J328RLFDKR-ND; Manufacturer Part Number: SSM3J328R,LF
R9 = RS_100K: RES 100K OHM 1/10W 5% 0603 SMD; Storage Location: PCB Assembly WS; Supplier: ECE Dept; Value: 100K
R10 R11 R13 R14 = RS_0R0: RES 0.0 OHM 1/10W 5% 0603 SMD; Storage Location: PCB Assembly WS; Supplier: ECE Dept; Value: 0R
R12 = RT_1R: RES 1R OHM 1/4W 5% 1206 SMD; Storage Location: PCB Assembly WS; Supplier: ECE Dept; Value: 1R
R15 R16 = RS_27R: RES 27 OHM 1/10W 5% 0603 SMD; Storage Location: PCB Assembly WS; Supplier: ECE Dept
  R15: Value: 470K
  R16: Value: 270K
R17 R20 = RS_10K: RES 10.0K OHM 1/10W 5% 0603 SMD; Storage Location: PCB Assembly WS; Supplier: ECE Dept; Value: 10K
R18 R19 = RS_47R: RES 47 OHM 1/10W 5% 0603 SMD; Storage Location: PCB Assembly WS; Supplier: ECE Dept
  R18: Value: 270K
  R19: Value: 470K
U1 = SE_ATSAM4S16BA-MU: as U1 on sheet MCU; PackageVersion: revJ, Jul-2007; PackageReference: 64PS; PackageDescription: 64-Pin Quad Flat No-Lead (QFN) Sawn, 9 x 9 x 1.0 mm Body, 0.5 mm Pitch, Exposed Pad; Code_JEDEC: MO-220VMMD-3; ComponentLink1Description: Manufacturer URL; ComponentLink1URL: http://www.atmel.com/; ComponentLink2Description: SAM4S Series Datasheet; ComponentLink2URL: http://www.atmel.com/dyn/resources/prod_documents/11100.pdf; ComponentLink3Description: SAM4S Series Summary; ComponentLink3URL: http://www.atmel.com/dyn/resources/prod_documents/11100S.pdf; Supplier 1: Digi-Key; Package / Case: 64-LQFP; Packaging: Cut Tape (CT); Program Memory Type: FLASH; Supplier Part Number 1: ATSAM4S8BA-ANRCT-ND; Manufacturer Part Number: ATSAM4S8BA-ANR

## Sheet Headers.SchDoc: Headers
size A3; DrawnBy: Hassan Alhujhoj, Abdullah Naeem; Address1: ECE Department; Address2: University of Canterbury; Address3: Christchurch 8041; Address4: New Zealand
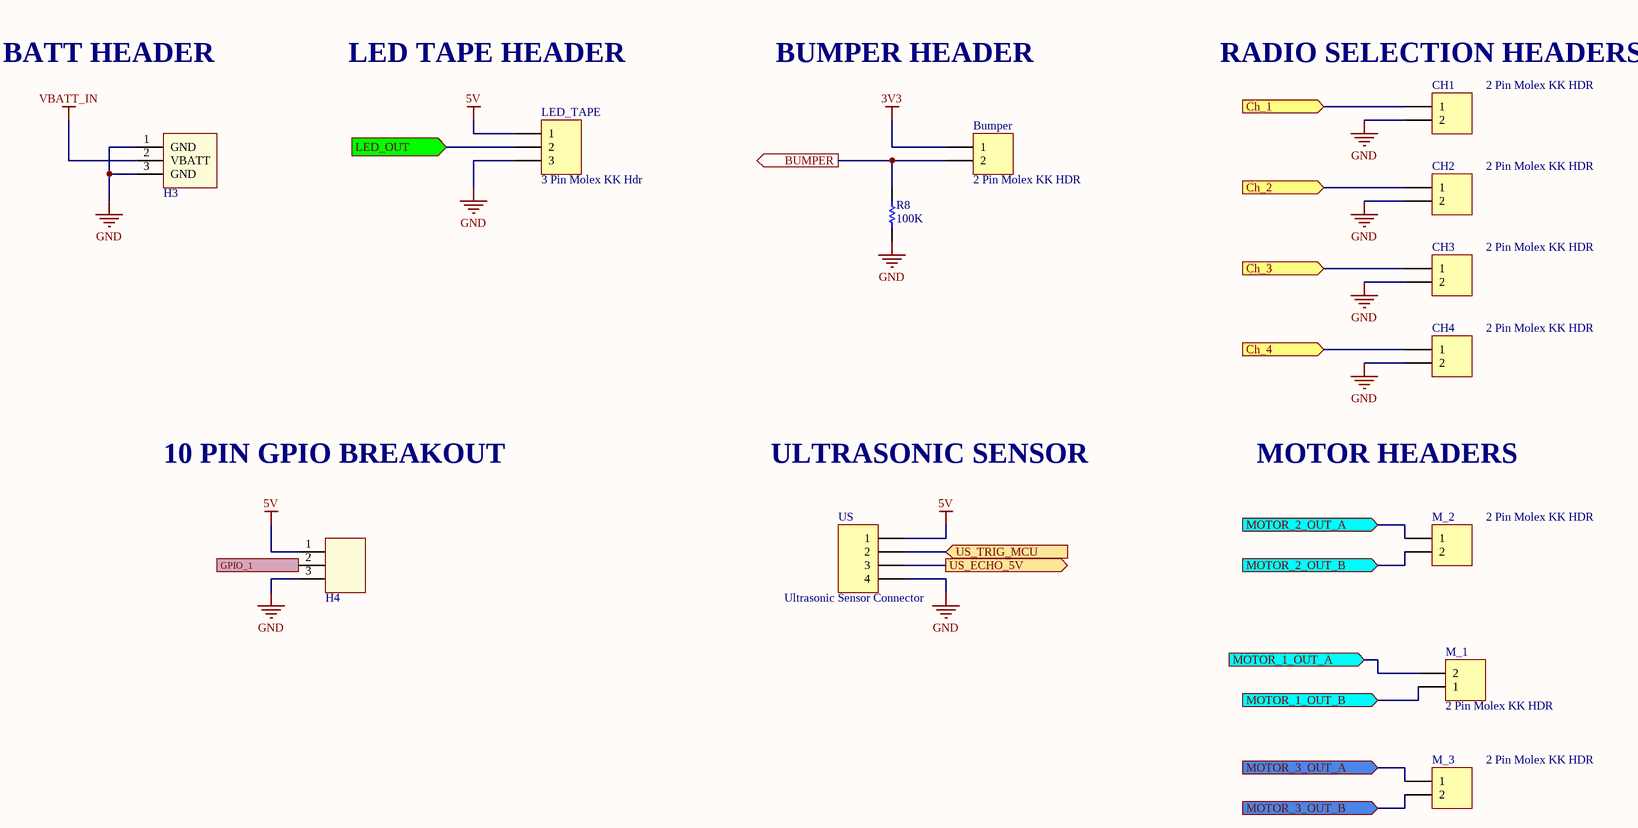
[diagram p2: Headers.SchDoc]

### Parts
Bumper  2 Pin Molex KK HDR  [MOLEX_KK_2_HDR]
CH1  2 Pin Molex KK HDR  [MOLEX_KK_2_HDR]
CH2  2 Pin Molex KK HDR  [MOLEX_KK_2_HDR]
CH3  2 Pin Molex KK HDR  [MOLEX_KK_2_HDR]
CH4  2 Pin Molex KK HDR  [MOLEX_KK_2_HDR]
H3  Battery_HEADER_3pin  [BATT_HEADER_3POS]  (value not drawn)
H4  HEADER_3  [HEADER_3POS]  (value not drawn)
LED_TAPE  3 Pin Molex KK Hdr  [MOLEX_KK_3_HDR]
M_1  2 Pin Molex KK HDR  [MOLEX_KK_2_HDR]
M_2  2 Pin Molex KK HDR  [MOLEX_KK_2_HDR]
M_3  2 Pin Molex KK HDR  [MOLEX_KK_2_HDR]
R8  100K  [RESC1608L]
US  Ultrasonic Sensor Connector  [MOLEX_KK_4_HDR]

### Ports
BUMPER (out), Ch_1 (in), Ch_2 (in), Ch_3 (in), Ch_4 (in), GPIO_1, LED_OUT (in), MOTOR_1_OUT_A (in), MOTOR_1_OUT_B (in), MOTOR_2_OUT_A (in), MOTOR_2_OUT_B (in), MOTOR_3_OUT_A (in), MOTOR_3_OUT_B (in), US_ECHO_5V (out), US_TRIG_MCU (in)

### Nets
3V3: Bumper.1
5V: H4.1 LED_TAPE.1 US.1
GND: CH1.2 CH2.2 CH3.2 CH4.2 H3.1(GND) H3.3(GND) H4.3 LED_TAPE.3 R8.1 US.4
VBATT_IN: H3.2(VBATT)
NetBumper_2: Bumper.2 R8.2 ; port BUMPER
NetCH1_1: CH1.1 ; port Ch_1
NetCH2_1: CH2.1 ; port Ch_2
NetCH3_1: CH3.1 ; port Ch_3
NetCH4_1: CH4.1 ; port Ch_4
NetH4_2: H4.2 ; port GPIO_1
NetH-Bridge_1_2: M_1.2 ; port MOTOR_1_OUT_A
NetH-Bridge_1_4: M_1.1 ; port MOTOR_1_OUT_B
NetH-Bridge_1_5: M_2.2 ; port MOTOR_2_OUT_B
NetH-Bridge_1_7: M_2.1 ; port MOTOR_2_OUT_A
NetH-Bridge_2_2: M_3.1 ; port MOTOR_3_OUT_A
NetH-Bridge_2_4: M_3.2 ; port MOTOR_3_OUT_B
NetLED_TAPE_2: LED_TAPE.2 ; port LED_OUT
NetR17_2: US.3 ; port US_ECHO_5V
NetU1_26: US.2 ; port US_TRIG_MCU

### Notes on the sheet
- BATT HEADER
- LED TAPE HEADER
- BUMPER HEADER
- (near CH1) RADIO SELECTION HEADERS
- 10 PIN GPIO BREAKOUT
- ULTRASONIC SENSOR
- MOTOR HEADERS
- Title
- Drawn by:
- Date:
- Time:
- Revision:
- Sheet
- of
- File:

### Library data of the parts
Bumper CH1-CH4 M_1-M_3 = JA_MOLEX_KK_2POS: CONN HEADER 2POS 2.54mm VERT_Thru Hole; Supplier 1: Farnell; Supplier Part Number 1: 1462926; Supplier: ECE Dept; Storage Location: ECE Dept Store; Value: 2 Pin Molex KK HDR
H3 = Battery_HEADER_3pin: 3Pin Header 2.54mm spacing
H4 = HEADER_3: 3Pin Header 2.54mm spacing
LED_TAPE = JA_MOLEX_KK_3POS: CONN HEADER 3POS 2.54mm VERT_Thru Hole; Manufacturer: Molex; Manufacturer PN: 22-23-2031; Supplier Part Number 1: 9731156; Supplier: ECE Dept; Supplier 1: Farnell; Storage Location: ECE Dept Store; Value: 3 Pin Molex KK Hdr
R8 = RS_100K: RES 100K OHM 1/10W 5% 0603 SMD; Storage Location: PCB Assembly WS; Supplier: ECE Dept; Value: 100K
US = JA_MOLEX_KK_4POS: CONN HEADER 4POS 2.54mm VERT_Thru Hole; Manufacturer: Molex; Manufacturer PN: 22-23-2041; Supplier Part Number 1: 9731164; Supplier: ECE Dept; Supplier 1: Farnell; Storage Location: ECE Dept Store; Value: Ultrasonic Sensor Connector

## Nets that join several sheets
3V3: MCU (5 pins), Power (15 pins), Headers (Bumper.1)
3V3RF: MCU (L1.2), Power (3V3RF_REG.5 C29.2)
5V: Power (11 pins), Headers (H4.1 LED_TAPE.1 US.1)
GND: MCU (11 pins), Power (47 pins), Headers (10 pins)
VBATT_IN: Power (F1.1), Headers (H3.2)
VBUS: MCU (C32.2 USB.1), Power (R16.2)
Net3V3RF_REG_3: MCU (U1.20), Power (3V3RF_REG.3)
NetBumper_2: MCU (U1.5), Headers (Bumper.2 R8.2)
NetCH1_1: MCU (U1.16), Headers (CH1.1)
NetCH2_1: MCU (U1.10), Headers (CH2.1)
NetCH3_1: MCU (U1.9), Headers (CH3.1)
NetCH4_1: MCU (U1.6), Headers (CH4.1)
NetH4_2: MCU (R4.2), Headers (H4.2)
NetH-Bridge_1_1: MCU (U1.36), Power (H-Bridge_1.1)
NetH-Bridge_1_2: Power (H-Bridge_1.2), Headers (M_1.2)
NetH-Bridge_1_4: Power (H-Bridge_1.4), Headers (M_1.1)
NetH-Bridge_1_5: Power (H-Bridge_1.5), Headers (M_2.2)
NetH-Bridge_1_7: Power (H-Bridge_1.7), Headers (M_2.1)
NetH-Bridge_1_8: MCU (U1.35), Power (H-Bridge_1.8)
NetH-Bridge_1_9: MCU (U1.44), Power (H-Bridge_1.9)
NetH-Bridge_1_10: MCU (U1.48), Power (H-Bridge_1.10)
NetH-Bridge_1_15: MCU (U1.41), Power (H-Bridge_1.15)
NetH-Bridge_1_16: MCU (U1.32), Power (H-Bridge_1.16)
NetH-Bridge_2_1: MCU (U1.38), Power (H-Bridge_2.1)
NetH-Bridge_2_2: Power (H-Bridge_2.2 H-Bridge_2.7), Headers (M_3.1)
NetH-Bridge_2_4: Power (H-Bridge_2.4 H-Bridge_2.5), Headers (M_3.2)
NetH-Bridge_2_8: MCU (U1.37), Power (H-Bridge_2.8)
NetH-Bridge_2_9: MCU (U1.47), Power (H-Bridge_2.9 H-Bridge_2.16)
NetH-Bridge_2_10: MCU (U1.42), Power (H-Bridge_2.10 H-Bridge_2.15)
NetLED_TAPE_2: Power (LVL_CON.4), Headers (LED_TAPE.2)
NetLVL_CON_3: MCU (U1.34), Power (LVL_CON.3)
NetR15_1: MCU (U1.25), Power (R15.1 R18.2)
NetR16_1: MCU (U1.4), Power (R16.1 R19.2)
NetR17_1: MCU (U1.30), Power (R17.1 R20.2)
NetR17_2: Power (R17.2), Headers (US.3)
NetU1_26: MCU (U1.26), Headers (US.2)